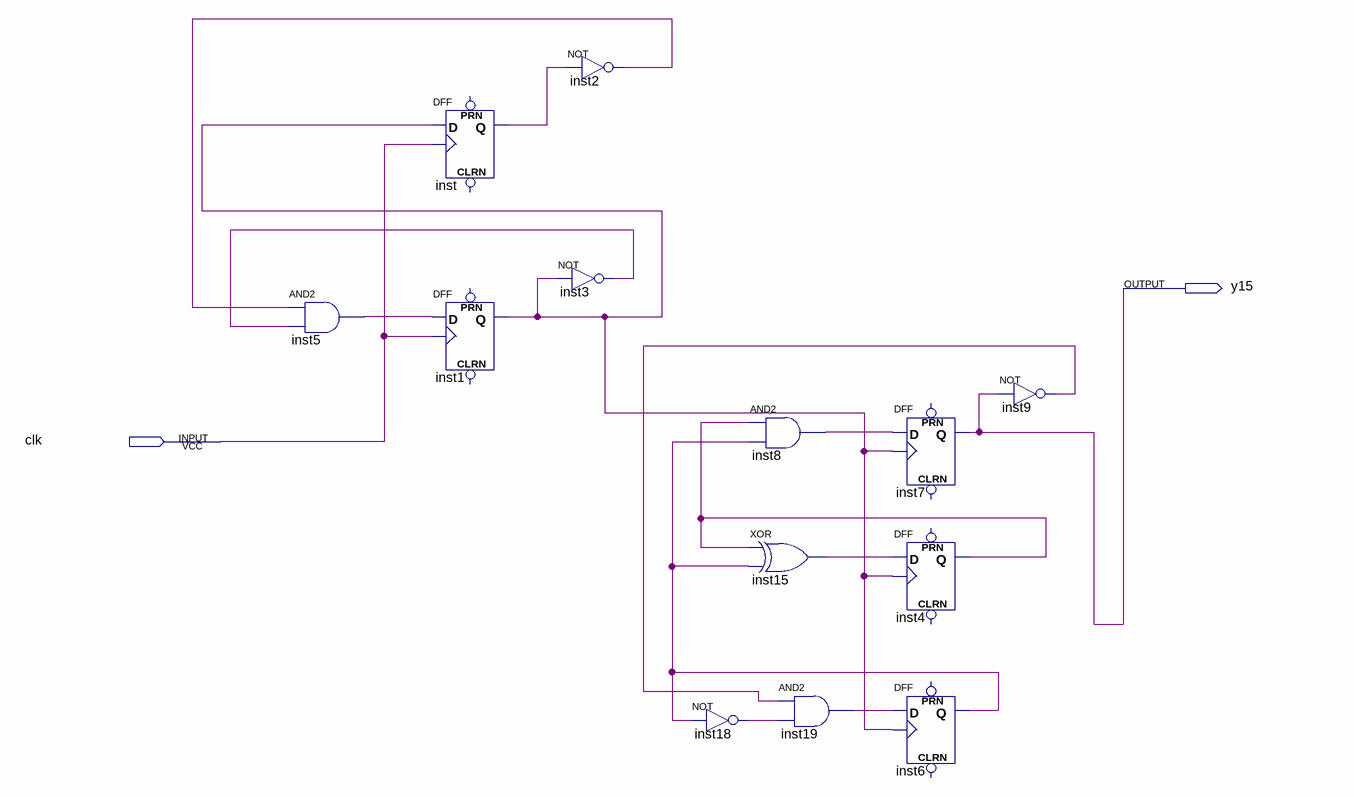
[diagram p0: schematic sheet]
// Quartus schematic 15Xdec.bdf as structural Verilog: 13 symbols, 2 pins
module \15Xdec  (
  input  clk,
  output y15
);

  wire inst1_q, inst2_out, inst3_out, inst4_q, inst5_out, inst6_q, inst8_out, inst9_out, inst15_out,
       inst18_out, inst19_out, inst_q;

  and inst5 (inst5_out, inst2_out, inst3_out);
  DFF inst (.CLK(clk), .D(inst1_q), .Q(inst_q));  // open: CLRN, PRN
  DFF inst1 (.CLK(clk), .D(inst5_out), .Q(inst1_q));  // open: CLRN, PRN
  not inst3 (inst3_out, inst1_q);
  not inst2 (inst2_out, inst_q);
  not inst18 (inst18_out, inst6_q);
  and inst8 (inst8_out, inst4_q, inst6_q);
  xor inst15 (inst15_out, inst4_q, inst6_q);
  and inst19 (inst19_out, inst9_out, inst18_out);
  DFF inst7 (.CLK(inst1_q), .D(inst8_out), .Q(y15));  // open: CLRN, PRN
  DFF inst4 (.CLK(inst1_q), .D(inst15_out), .Q(inst4_q));  // open: CLRN, PRN
  DFF inst6 (.CLK(inst1_q), .D(inst19_out), .Q(inst6_q));  // open: CLRN, PRN
  not inst9 (inst9_out, y15);
endmodule
